# Altium project UIC1203R_MEZ.PrjPCB
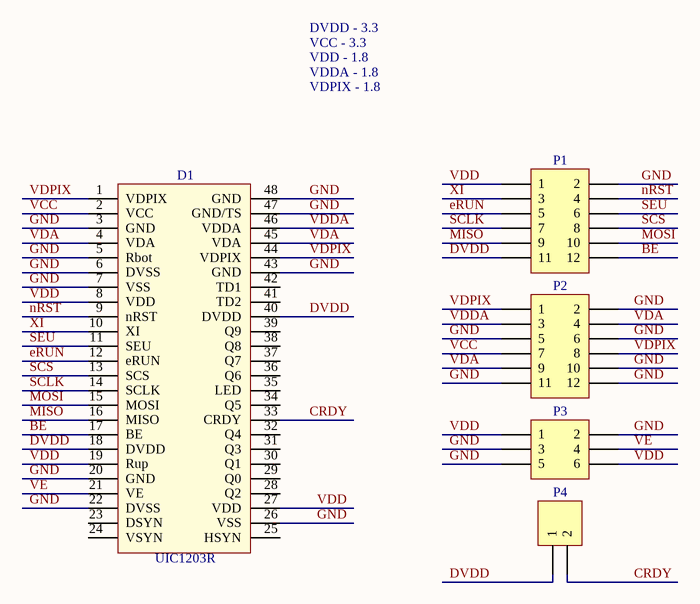
[diagram p0: Mez.SchDoc]
1 sheet, 5 parts. Net scope: global (net labels, ports and power ports of the same name join across sheets).
Board file: MezPCB.PcbDoc

## Sheet Mez.SchDoc
size A4

### Parts
D1  UIC1203R  [UIC1203R]
P1  Header 6X2  [HDR2X6]  (value not drawn)
P2  Header 6X2  [HDR2X6]  (value not drawn)
P3  Header 3X2  [HDR2X3]  (value not drawn)
P4  Header 2  [HDR1X2]  (value not drawn)

### Nets
BE: D1.17(BE) P1.12
CRDY: D1.33(CRDY) P4.2
DVDD: D1.18(DVDD) D1.40(DVDD) P1.11 P4.1
eRUN: D1.12(eRUN) P1.5
GND: D1.3(GND) D1.5(Rbot) D1.6(DVSS) D1.7(VSS) D1.20(GND) D1.22(DVSS) D1.26(VSS) D1.43(GND) D1.47(GND/TS) D1.48(GND) P1.2 P2.2 P2.5 P2.6 P2.10 P2.11 P2.12 P3.2 P3.3 P3.5
MISO: D1.16(MISO) P1.9
MOSI: D1.15(MOSI) P1.10
nRST: D1.9(nRST) P1.4
SCLK: D1.14(SCLK) P1.7
SCS: D1.13(SCS) P1.8
SEU: D1.11(SEU) P1.6
VCC: D1.2(VCC) P2.7
VDA: D1.4(VDA) D1.45(VDA) P2.4 P2.9
VDD: D1.8(VDD) D1.19(Rup) D1.27(VDD) P1.1 P3.1 P3.6
VDDA: D1.46(VDDA) P2.3
VDPIX: D1.1(VDPIX) D1.44(VDPIX) P2.1 P2.8
VE: D1.21(VE) P3.4
XI: D1.10(XI) P1.3

Not connected (* = marked no-connect by the designer): D1 23(DSYN) 24(VSYN) 25(HSYN) 28(Q2) 29(Q0) 30(Q1) 31(Q3) 32(Q4) 34(Q5) 35(LED) 36(Q6) 37(Q7) 38(Q8) 39(Q9) 41(TD2) 42(TD1)

### Notes on the sheet
- DVDD - 3.3
- VCC - 3.3
- VDD - 1.8
- VDDA - 1.8
- VDPIX - 1.8

### Library data of the parts
P1 P2 = Header 6X2: Header, 6-Pin, Dual row; LatestRevisionDate: 17-Jul-2002; LatestRevisionNote: Re-released for DXP Platform.; Publisher: Altium Limited
P3 = Header 3X2: Header, 3-Pin, Dual row; LatestRevisionDate: 17-Jul-2002; LatestRevisionNote: Re-released for DXP Platform.; Publisher: Altium Limited
P4 = Header 2: Header, 2-Pin; LatestRevisionDate: 17-Jul-2002; LatestRevisionNote: Re-released for DXP Platform.; Publisher: Altium Limited